# EAGLE design Vrefs4:2 (EAGLE 9.2.2)
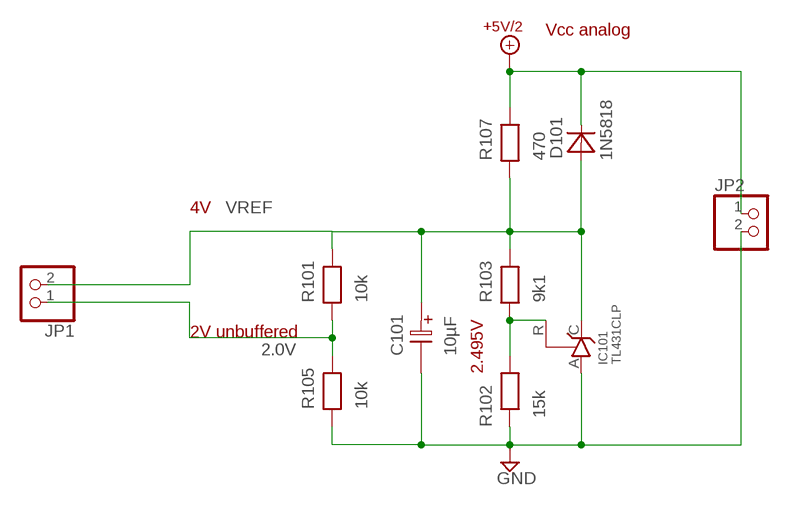
[diagram p0: schematic, sheet 1]

## Parts
C101  10µF  ELC-5  [EL25B]
D101  1N5818  DIODE-10  [D-10]
IC101  TL431CLP  [TO92-CLP]
JP1  PINHD-1X2  [1X02]
JP2  PINHD-1X2  [1X02]
R101  10k  RESEU-10  [R-10]
R102  15k  RESEU-10  [R-10]
R103  9k1  RESEU-10  [R-10]
R105  10k  RESEU-10  [R-10]
R107  470  RESEU-10  [R-10]

## Nets
2.0V: JP1.1 R101.1 R105.2
+5V/2: D101.2(K) JP2.1 R107.2
GND: C101.2 IC101.A JP2.2 R102.1 R105.1
N$4: IC101.R R102.2 R103.1
VREF: C101.1 D101.1(A) IC101.C JP1.2 R101.2 R103.2 R107.1

## Notes on the sheet
- Vcc analog
- 4V
- 2V unbuffered
- 2.495V

## Library data of the parts
C101 = DISCRETE:ELC-5
D101 = DISCRETE:DIODE-10
IC101 = V-REG:TL431CLP
JP1 JP2 = pinhead:PINHD-1X2: PIN HEADER
R101-R103 R105 R107 = DISCRETE:RESEU-10

## Board
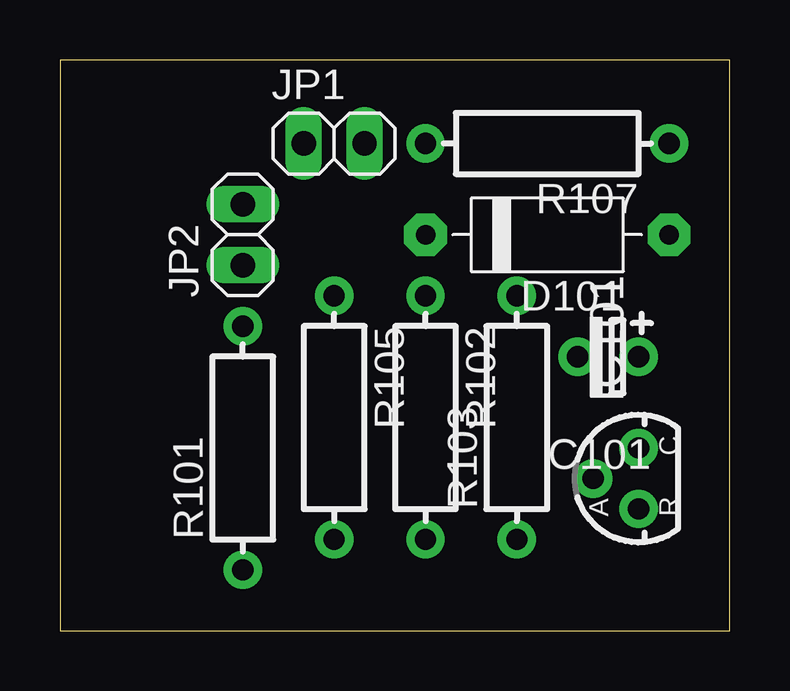
[diagram p1: board, top side]
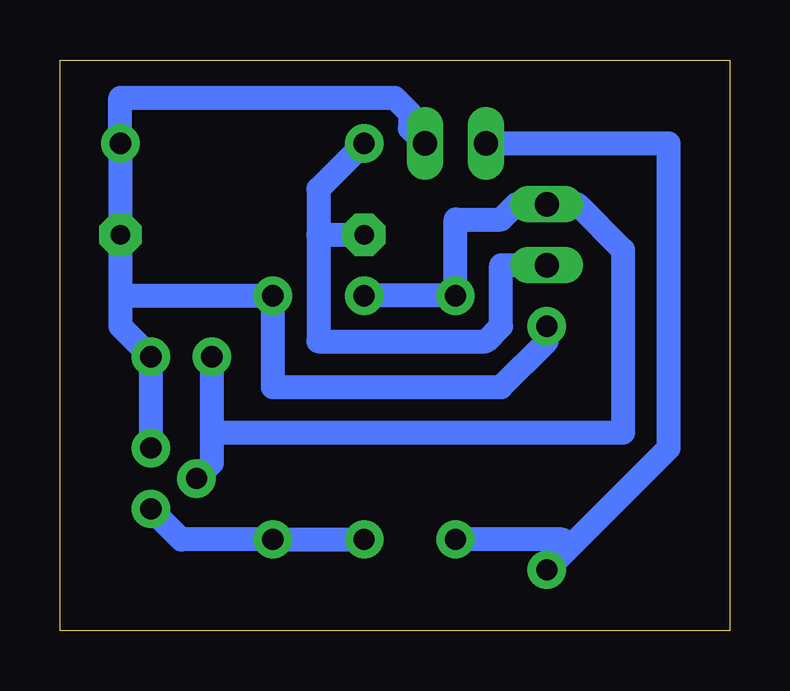
[diagram p2: board, bottom side, seen from below]

Size 27.92 x 23.8 mm. Coordinates in mm from the lower left corner, seen from the top.
Outline: 0,0 27.92,0 27.92,23.8 0,23.8 0,0
Copper layers (1*16): Top 0.035mm / dielectric 1.5mm / Bottom 0.035mm
Design rules "default *": minimum track width 1mm, minimum drill 0.35mm, track to track 0.6mm, track to pad 0.6mm, pad to pad 0.6mm, via to via 0.6mm, smd to smd 6mil, copper to edge 40mil, drill to drill 6mil, minimum pad ring 10mil, minimum via ring 8mil, stop-mask expansion 4mil, vias tented up to drill 0mil, thermal gap 10mil

### Footprints (pad centres in the part's own frame; a part is rotated, then mirrored left to right if it is on the bottom)
EL25B = drill 0.889 pad 1.6: 1 -1.27,0; 2 1.27,0
D-10 = drill 0.813 pad 1.778 octagon: 1 -5.08,0; 2 5.08,0
TO92-CLP = drill 0.889 pad 1.6: A 0,1.905; C 1.27,0; R -1.27,0
1X02 = drill 1.016 long: 1 -1.27,0; 2 1.27,0
R-10 = drill 0.889 pad 1.6: 1 -5.08,0; 2 5.08,0

### Placement (x,y rotation side)
C101  22.86,11.43 180 top
D101  20.32,16.51 180 top
IC101  24.13,6.35 90 top
JP1  11.43,20.32 0 top
JP2  7.62,16.51 90 top
R101  7.62,7.62 90 top
R102  15.24,8.89 270 top
R103  19.05,8.89 90 top
R105  11.43,8.89 270 top
R107  20.32,20.32 180 top

### Tracks (layer width: path | path; a pad name or v marks a point on that pad's centre or on a via)
2.0V
  Bottom 1: JP1.1 2.54,20.32 2.54,7.62 6.67,3.49 | R101.1 6.67,3.49 | R105.2 6.99,3.81 6.67,3.49
+5V/2
  Bottom 1: JP2.1 9.53,15.24 9.53,12.7 10.16,12.06 17.14,12.06 17.14,16.51 | 17.14,16.51 17.14,18.41 R107.2 | 17.14,16.51 D101.2
GND
  Bottom 1: IC101.A 21.59,6.99 21.59,8.26 | C101.2 21.59,8.26 | R102.1 R105.1 11.43,17.14 9.53,17.14 8.89,17.78 JP2.2 6.35,17.78 4.45,15.88 4.45,8.26 21.59,8.26
N$4
  Bottom 1: R102.2 R103.1 22.86,3.81 IC101.R
VREF
  Bottom 1: R101.2 7.62,12.06 9.53,10.16 19.05,10.16 R103.2 25.4,13.97 | IC101.C C101.1 25.4,12.7 25.4,13.97 | JP1.2 13.34,20.95 13.34,21.59 13.97,22.23 25.4,22.23 R107.1 D101.1 25.4,13.97